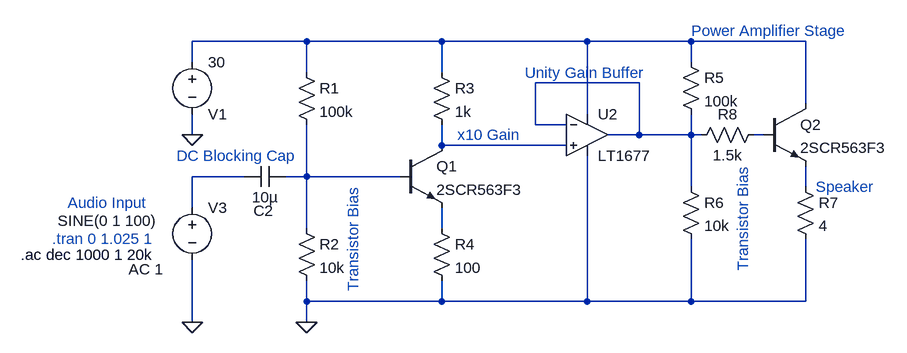
[diagram p0: schematic Class_A_Audio_Amplifier.asc]
Class_A_Audio_Amplifier.asc, the LTspice schematic file:
Version 4
SHEET 1 1304 680
WIRE 176 -240 0 -240
WIRE 384 -240 176 -240
WIRE 608 -240 384 -240
WIRE 768 -240 608 -240
WIRE 944 -240 768 -240
WIRE 0 -208 0 -240
WIRE 768 -208 768 -240
WIRE 176 -192 176 -240
WIRE 384 -192 384 -240
WIRE 688 -176 528 -176
WIRE 944 -144 944 -240
WIRE 608 -128 608 -240
WIRE 528 -112 528 -176
WIRE 576 -112 528 -112
WIRE 0 -96 0 -128
WIRE 688 -96 688 -176
WIRE 688 -96 640 -96
WIRE 768 -96 768 -128
WIRE 768 -96 688 -96
WIRE 784 -96 768 -96
WIRE 880 -96 864 -96
WIRE 384 -80 384 -112
WIRE 576 -80 384 -80
WIRE 80 -32 0 -32
WIRE 176 -32 176 -112
WIRE 176 -32 144 -32
WIRE 320 -32 176 -32
WIRE 768 -16 768 -96
WIRE 944 -16 944 -48
WIRE 0 16 0 -32
WIRE 176 48 176 -32
WIRE 384 48 384 16
WIRE 176 160 176 128
WIRE 384 160 384 128
WIRE 384 160 176 160
WIRE 608 160 608 -64
WIRE 608 160 384 160
WIRE 768 160 768 64
WIRE 768 160 608 160
WIRE 944 160 944 64
WIRE 944 160 768 160
WIRE 0 192 0 96
WIRE 176 192 176 160
FLAG 0 192 0
FLAG 176 192 0
FLAG 0 -96 0
SYMBOL res 160 -208 R0
SYMATTR InstName R1
SYMATTR Value 100k
SYMBOL res 160 32 R0
SYMATTR InstName R2
SYMATTR Value 10k
SYMBOL res 368 -208 R0
SYMATTR InstName R3
SYMATTR Value 1k
SYMBOL res 368 32 R0
SYMATTR InstName R4
SYMATTR Value 100
SYMBOL voltage 0 -224 R0
WINDOW 0 24 96 Left 2
WINDOW 3 24 16 Left 2
WINDOW 123 0 0 Left 0
WINDOW 39 0 0 Left 0
SYMATTR InstName V1
SYMATTR Value 30
SYMBOL voltage 0 0 R0
WINDOW 123 -98 111 Left 2
WINDOW 39 0 0 Left 0
WINDOW 3 -207 36 Left 2
SYMATTR Value2 AC 1
SYMATTR InstName V3
SYMATTR Value SINE(0 1 100)
SYMBOL cap 144 -48 R90
WINDOW 0 84 34 VBottom 2
WINDOW 3 32 32 VTop 2
SYMATTR InstName C2
SYMATTR Value 10µ
SYMBOL npn 320 -80 R0
SYMATTR InstName Q1
SYMATTR Value 2SCR563F3
SYMBOL res 752 -224 R0
SYMATTR InstName R5
SYMATTR Value 100k
SYMBOL res 752 -32 R0
SYMATTR InstName R6
SYMATTR Value 10k
SYMBOL res 928 -32 R0
SYMATTR InstName R7
SYMATTR Value 4
SYMBOL npn 880 -144 R0
SYMATTR InstName Q2
SYMATTR Value 2SCR563F3
SYMBOL OpAmps\\LT1677 608 -160 R0
SYMATTR InstName U2
SYMBOL res 880 -112 R90
WINDOW 0 0 56 VBottom 2
WINDOW 3 32 56 VTop 2
SYMATTR InstName R8
SYMATTR Value 1.5k
TEXT -216 64 Left 2 ;.tran 0 1.025 1
TEXT -264 88 Left 2 !.ac dec 1000 1 20k
TEXT -192 8 Left 2 ;Audio Input
TEXT -24 -64 Left 2 ;DC Blocking Cap
TEXT 248 -16 VRight 2 ;Transistor Bias
TEXT 408 -96 Left 2 ;x10 Gain
TEXT 512 -192 Left 2 ;Unity Gain Buffer
TEXT 768 -256 Left 2 ;Power Amplifier Stage
TEXT 960 -16 Left 2 ;Speaker
TEXT 848 -48 VRight 2 ;Transistor Bias

The netlist it stands for:
* Class_A_Audio_Amplifier.asc
R1 N001 N006 100k
R2 N006 0 10k
R3 N001 N004 1k
R4 N008 0 100
V1 N001 0 30
V3 N005 0 SINE(0 1 100) AC 1
C2 N006 N005 10µ
Q1 N004 N006 N008 0 2SCR563F3
R5 N001 N002 100k
R6 N002 0 10k
R7 N007 0 4
Q2 N001 N003 N007 0 2SCR563F3
XU2 N004 N002 N001 0 N002 LT1677  ; pins In+ In- V+ V- OUT
R8 N003 N002 1.5k
.model NPN NPN
.model PNP PNP
.lib standard.bjt
* .tran 0 1.025 1
.ac dec 1000 1 20k
* Audio Input
* DC Blocking Cap
* Transistor Bias
* x10 Gain
* Unity Gain Buffer
* Power Amplifier Stage
* Speaker
* Transistor Bias
.lib LTC.lib
.backanno
.end